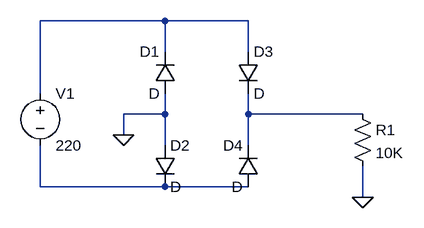
[diagram p0: schematic Home work 1.asc]
Home work 1.asc, the LTspice schematic file:
Version 4
SHEET 1 880 680
WIRE 400 -416 208 -416
WIRE 528 -416 400 -416
WIRE 400 -368 400 -416
WIRE 528 -368 528 -416
WIRE 208 -304 208 -416
WIRE 400 -272 400 -304
WIRE 400 -272 336 -272
WIRE 528 -272 528 -304
WIRE 704 -272 528 -272
WIRE 336 -240 336 -272
WIRE 400 -224 400 -272
WIRE 528 -224 528 -272
WIRE 208 -160 208 -224
WIRE 400 -160 208 -160
WIRE 528 -160 400 -160
WIRE 704 -144 704 -192
FLAG 336 -240 0
FLAG 704 -144 0
SYMBOL voltage 208 -320 R0
WINDOW 123 0 0 Left 0
WINDOW 39 0 0 Left 0
SYMATTR InstName V1
SYMATTR Value 220
SYMBOL diode 416 -304 R180
WINDOW 0 24 64 Left 2
WINDOW 3 24 0 Left 2
SYMATTR InstName D1
SYMBOL diode 384 -224 R0
SYMATTR InstName D2
SYMBOL res 688 -288 R0
SYMATTR InstName R1
SYMATTR Value 10K
SYMBOL diode 512 -368 R0
SYMATTR InstName D3
SYMBOL diode 544 -160 R180
WINDOW 0 24 64 Left 2
WINDOW 3 24 0 Left 2
SYMATTR InstName D4

The netlist it stands for:
* Home work 1.asc
V1 N001 N003 220
D1 0 N001 D
D2 0 N003 D
R1 N002 0 10K
D3 N001 N002 D
D4 N003 N002 D
.model D D
.lib standard.dio
.backanno
.end